# Altium schematic sheet MCU.SchDoc
size A4; SheetNumber: 2; SheetTotal: 5
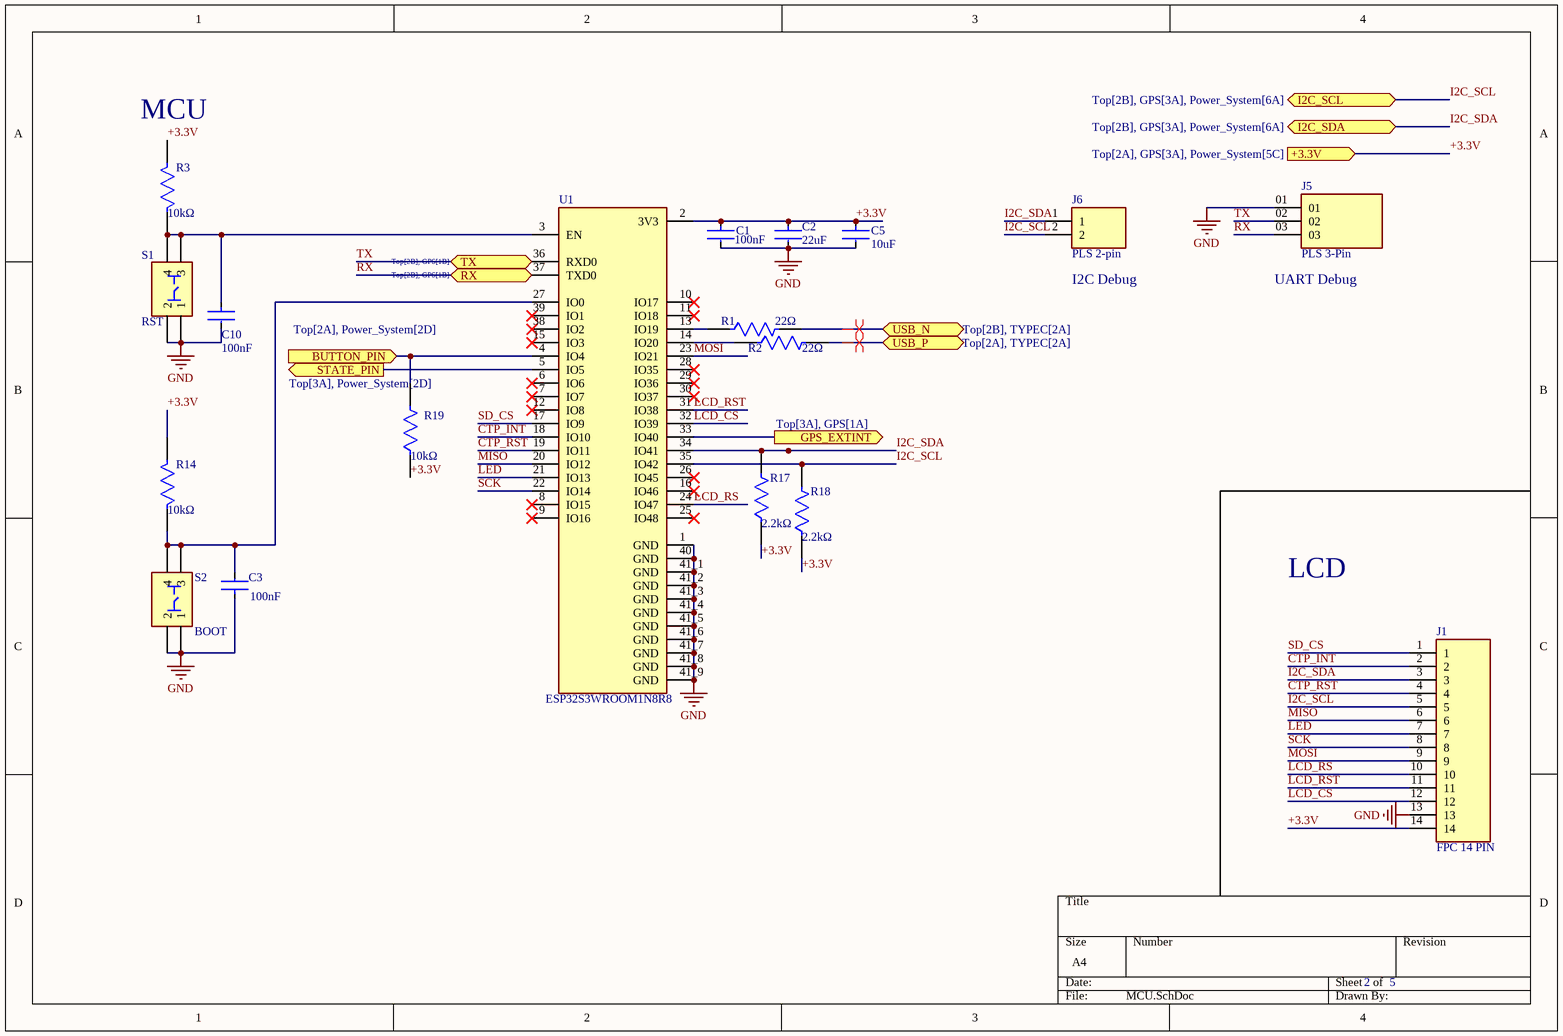
[diagram p0: MCU.SchDoc]

## Parts
C1  100nF  [0603_CAPACITOR]
C2  22uF  [0603_CAPACITOR]
C3  100nF  [0603_CAPACITOR]
C5  10uF  [0603_CAPACITOR]
C10  100nF  [0603_CAPACITOR]
J1  FPC 14 PIN  [AMPHENOL_10051922-1410ELF]
J5  PLS 3-Pin  [SAMTEC_MTLW-103-05-G-S-135]
J6  PLS 2-pin  [2-pin_pls]
R1  value 22Ω  [0402_RESISTOR]  (hidden comment: RESISTOR)
R2  value 22Ω  [0402_RESISTOR]  (hidden comment: RESISTOR)
R3  value 10kΩ  [0603_RESISTOR]  (hidden comment: RESISTOR)
R14  value 10kΩ  [0603_RESISTOR]  (hidden comment: RESISTOR)
R17  value 2.2kΩ  [0603_RESISTOR]  (hidden comment: RESISTOR)
R18  value 2.2kΩ  [0603_RESISTOR]  (hidden comment: RESISTOR)
R19  value 10kΩ  [0402_RESISTOR]  (hidden comment: RESISTOR)
S1  RST  [SMD_BUTTON]
S2  BOOT  [SMD_BUTTON]
U1  ESP32S3WROOM1N8R8  [XCVR_ESP32S3WROOM1N8R8]

## Ports
+3.3V (in, see Top[2A], GPS[3A], Power_System[5C]), BUTTON_PIN (in, see Top[2A], Power_System[2D]), GPS_EXTINT (out, see Top[3A], GPS[1A]), I2C_SCL (bidir, see Top[2B], GPS[3A], Power_System[6A]), I2C_SDA (bidir, see Top[2B], GPS[3A], Power_System[6A]), RX (bidir, see Top[2B], GPS[1B]), STATE_PIN (out, see Top[3A], Power_System[2D]), TX (bidir, see Top[2B], GPS[1B]), USB_N (bidir, see Top[2B], TYPEC[2A]), USB_P (bidir, see Top[2A], TYPEC[2A])

## Nets
GND: C1.2 C2.2 C3.1 C5.2 C10.2 J1.13 J5.01 S1.1 S1.2 S2.1 S2.2 U1.1(GND) U1.40(GND) U1.41_1(GND) U1.41_2(GND) U1.41_3(GND) U1.41_4(GND) U1.41_5(GND) U1.41_6(GND) U1.41_7(GND) U1.41_8(GND) U1.41_9(GND)
+3.3V: C1.1 C2.1 C5.1 J1.14 R3.2 R14.2 R17.1 R18.1 R19.1 U1.2(3V3) ; port +3.3V
BUTTON_PIN: R19.2 U1.4(IO4) ; port BUTTON_PIN
CTP_INT: J1.2 U1.18(IO10)
CTP_RST: J1.4 U1.19(IO11)
GPS_EXTINT: U1.33(IO40) ; port GPS_EXTINT
I2C_SCL: J1.5 J6.2 R18.2 U1.35(IO42) ; port I2C_SCL
I2C_SDA: J1.3 J6.1 R17.2 U1.34(IO41) ; port I2C_SDA
LCD_CS: J1.12 U1.32(IO39)
LCD_RS: J1.10 U1.24(IO47)
LCD_RST: J1.11 U1.31(IO38)
LED: J1.7 U1.21(IO13)
MISO: J1.6 U1.20(IO12)
MOSI: J1.9 U1.23(IO21)
RX: J5.03 U1.37(TXD0) ; port RX
SCK: J1.8 U1.22(IO14)
SD_CS: J1.1 U1.17(IO9)
STATE_PIN: U1.5(IO5) ; port STATE_PIN
TX: J5.02 U1.36(RXD0) ; port TX
USB_N: R1.2 ; port USB_N
USB_P: R2.2 ; port USB_P
NetC3_2: C3.2 R14.1 S2.3 S2.4 U1.27(IO0)
NetC10_1: C10.1 R3.1 S1.3 S1.4 U1.3(EN)
NetR1_1: R1.1 U1.13(IO19)
NetR2_1: R2.1 U1.14(IO20)

Not connected (* = marked no-connect by the designer): U1 6(IO6)* 7(IO7)* 8(IO15)* 9(IO16)* 10(IO17)* 11(IO18)* 12(IO8)* 15(IO3)* 16(IO46)* 25(IO48)* 26(IO45)* 28(IO35)* 29(IO36)* 30(IO37)* 38(IO2)* 39(IO1)*

## Layout directives
differential pair: USB_N, USB_P

## Notes on the sheet
- (near R3) MCU
- (near J6) I2C Debug
- (near J5) UART Debug
- LCD

## Library data of the parts
C1-C3 C5 C10 = CMP-001-00091-1: Design Item ID: CAPACITOR; Source: gps_project_schematic_library.SchLib
J1 = FPC 14 PIN: Conn;Rect; FPC/FFC; 14 Pos; Rt. Ang; 0.5 mm; SMT;ZIF; Low Side Cont; VLL Ser; LF | Amphenol FCI (Amphenol CS) 10051922-1410ELF; SnapEDA_Link: https://www.snapeda.com/parts/10051922-1410ELF/Amphenol/view-part/?ref=snap; Package: None; Value: *; MF: Amphenol; MP: 10051922-1410ELF; Check_prices: https://www.snapeda.com/parts/10051922-1410ELF/Amphenol/view-part/?ref=eda
J5 = MTLW-103-05-G-S-135: CONN HEADER VERT 3POS 2.54MM; MF: Samtec; SnapEDA_Link: https://www.snapeda.com/parts/MTLW-103-05-G-S-135/Samtec/view-part/?ref=snap; Package: None; Value: *; MP: MTLW-103-05-G-S-135; Check_prices: https://www.snapeda.com/parts/MTLW-103-05-G-S-135/Samtec/view-part/?ref=eda
J6 = PLS 2-pin: Conn Unshrouded Header HDR 2 POS 2.54mm Solder ST Thru-Hole; Centerline_Pitch: 2.54 mm[.1 in]; Product_Type: Connector; MF: TE Connectivity; Number_of_Positions: 2; MP: 826646-2; Availability: Good; Price: None; EU_RoHS_Compliance: Compliant; Value: *; DigiKey-Purchase-URL: https://snapeda.com/shop?store=DigiKey&id=470405; Mouser-Purchase-URL: https://snapeda.com/shop?store=Mouser&id=470405; SnapEDA_Link: https://www.snapeda.com/parts/826646-2/TE%20Connectivity%20AMP%20Connectors/view-part/470405/?ref=snap; Package: None
S1 S2 = SMD_BUTTON: Tactile Switch SPST-NO Top Actuated Surface Mount; MF: C&K; MP: PTS810 SJK 250 SMTR LFS; SnapEDA_Link: https://www.snapeda.com/parts/PTS810%20SJK%20250%20SMTR%20LFS/C%2526K/view-part/?ref=snap; Package: None; Value: *; Check_prices: https://www.snapeda.com/parts/PTS810%20SJK%20250%20SMTR%20LFS/C%2526K/view-part/?ref=eda
U1 = ESP32S3WROOM1N8R8: Bluetooth, WiFi 802.11b/g/n, Bluetooth v5.0 Transceiver Module 2.4GHz PCB Trace Surface Mount; MF: Espressif Systems; Price: None; MP: ESP32S3WROOM1N8R8; SnapEDA_Link: https://www.snapeda.com/parts/ESP32S3WROOM1N8R8/Espressif+Systems/view-part/?ref=snap; Package: SMD-41 Espressif Systems; Availability: In Stock; Purchase-URL: https://pricing.snapeda.com/search/part/ESP32S3WROOM1N8R8/?ref=eda; Check_prices: https://www.snapeda.com/parts/ESP32S3WROOM1N8R8/Espressif+Systems/view-part/?ref=eda; Value: *